# EAGLE schematic Transimpedance amplifier (EAGLE 9.5.2)
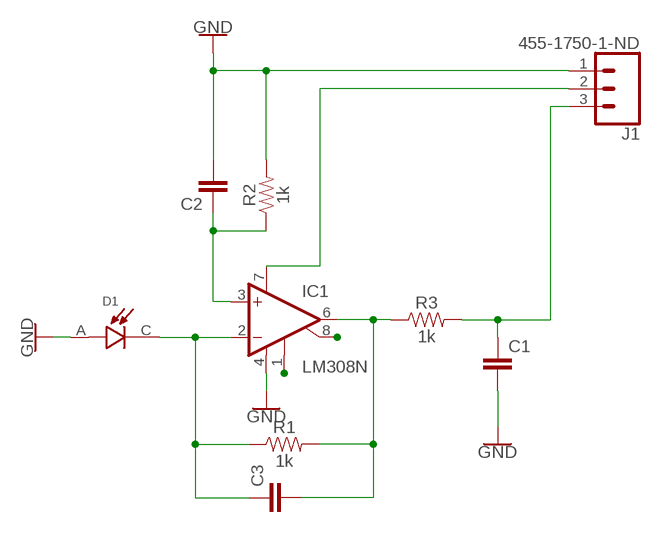
[diagram p0: schematic, sheet 1]

## Parts
C1  C2.5/2  [C2.5-2]
C2  C2.5/2  [C2.5-2]
C3  C2.5/2  [C2.5-2]
D1  BPW_21  [TO254P950H570-2]
IC1  LM308N  [DIL08]
J1  455-1750-1-ND  CONN_03  [1X03]
R1  1k  1KOHM-HORIZ-1/4W-5%  [AXIAL-0.3]
R2  1k  1KOHM-HORIZ-1/4W-5%  [AXIAL-0.3]
R3  1k  1KOHM-HORIZ-1/4W-1%  [AXIAL-0.3]

## Nets
GND [Ground]: C1.2 C2.2 D1.A IC1.4(V-) J1.1 R2.P$2
N$1 [Ground]: C3.1 D1.C IC1.2(-IN) R1.P$1
N$2 [Ground]: C3.2 IC1.6(OUT) R1.P$2 R3.P$1
N$3 [Ground]: C2.1 IC1.3(+IN) R2.P$1
N$4: IC1.1(CMP1)
N$5 [Ground]: C1.1 J1.3 R3.P$2
N$7 [Ground]: IC1.7(V+) J1.2
N$8: IC1.8(CMP2)

## Library data of the parts
C1-C3 = capacitor-wima:C: CAPACITOR naming: grid - package width
D1 = BPW_21:BPW_21: Silicon Photodiode for the Visible Spectral Range; AVAILABILITY: Unavailable; DESCRIPTION: Photodiode 550nm 1.5µs 110° TO-39; MF: OSRAM Opto; MP: BPW 21; PACKAGE: TSSOP-14 OSRAM Opto Semiconductors Inc; PRICE: None
IC1 = linear:LM308: OP AMP
J1 = SparkFun-Connectors:CONN_03: Multi connection point. Often used as Generic Header-pin footprint for 0.1 inch spaced/style header connections On any of the 0.1 inch spaced packages, you can populate with these: Break Away Headers - Straight <https://www.sparkfun.com/products/116> (PRT-00116) Break Away Male Headers - Right Angle <https://www.sparkfun.com/products/553> (PRT-00553) Female Headers <https://www.sparkfun.com/products/115> (PRT-00115) Break Away Headers - Machine Pin <https://www.sparkfun.com/products/117> (PRT-00117) Break Away Female Headers - Swiss Machine Pin <https://www.sparkfun.com/products/743> (PRT-00743) Stackable Header - 3 Pin (Female, 0.1") <https://www.sparkfun.com/products/13875> (PRT-13875) For SCREWTERMINALS and SPRING TERMINALS visit here: Screw Terimnals on SparkFun.com <https://www.sparkfun.com/search/results?term=Screw+Terminals> (5mm/3.5mm/2.54mm spacing) This device is also useful as a general connection point to wire up your design to another part of your project. Our various solder wires solder well into these plated through hole pads. Hook-Up Wire - Assortment (Stranded, 22 AWG) <https://www.sparkfun.com/products/11375> (PRT-11375) Hook-Up Wire - Assortment (Solid Core, 22 AWG) <https://www.sparkfun.com/products/11367> (PRT-11367) View the entire wire category on our website here <https://www.sparkfun.com/categories/141> Special notes: Molex polarized connector foot print use with SKU : PRT-08232 with associated crimp pins and housings.; PROD_ID: XXX-00000
R1 R2 = SparkFun-Resistors:1KOHM: 1kΩ resistor A resistor is a passive two-terminal electrical component that implements electrical resistance as a circuit element. Resistors act to reduce current flow, and, at the same time, act to lower voltage levels within circuits. - Wikipedia; PROD_ID: RES-08380
R3 = SparkFun-Resistors:1KOHM: 1kΩ resistor A resistor is a passive two-terminal electrical component that implements electrical resistance as a circuit element. Resistors act to reduce current flow, and, at the same time, act to lower voltage levels within circuits. - Wikipedia; PROD_ID: RES-12182

## Net classes
1 Ground: width 1.27 mm, drill 0.508 mm, clearance 0.152 mm